# EAGLE design tutorial2 (EAGLE 9.6.2)
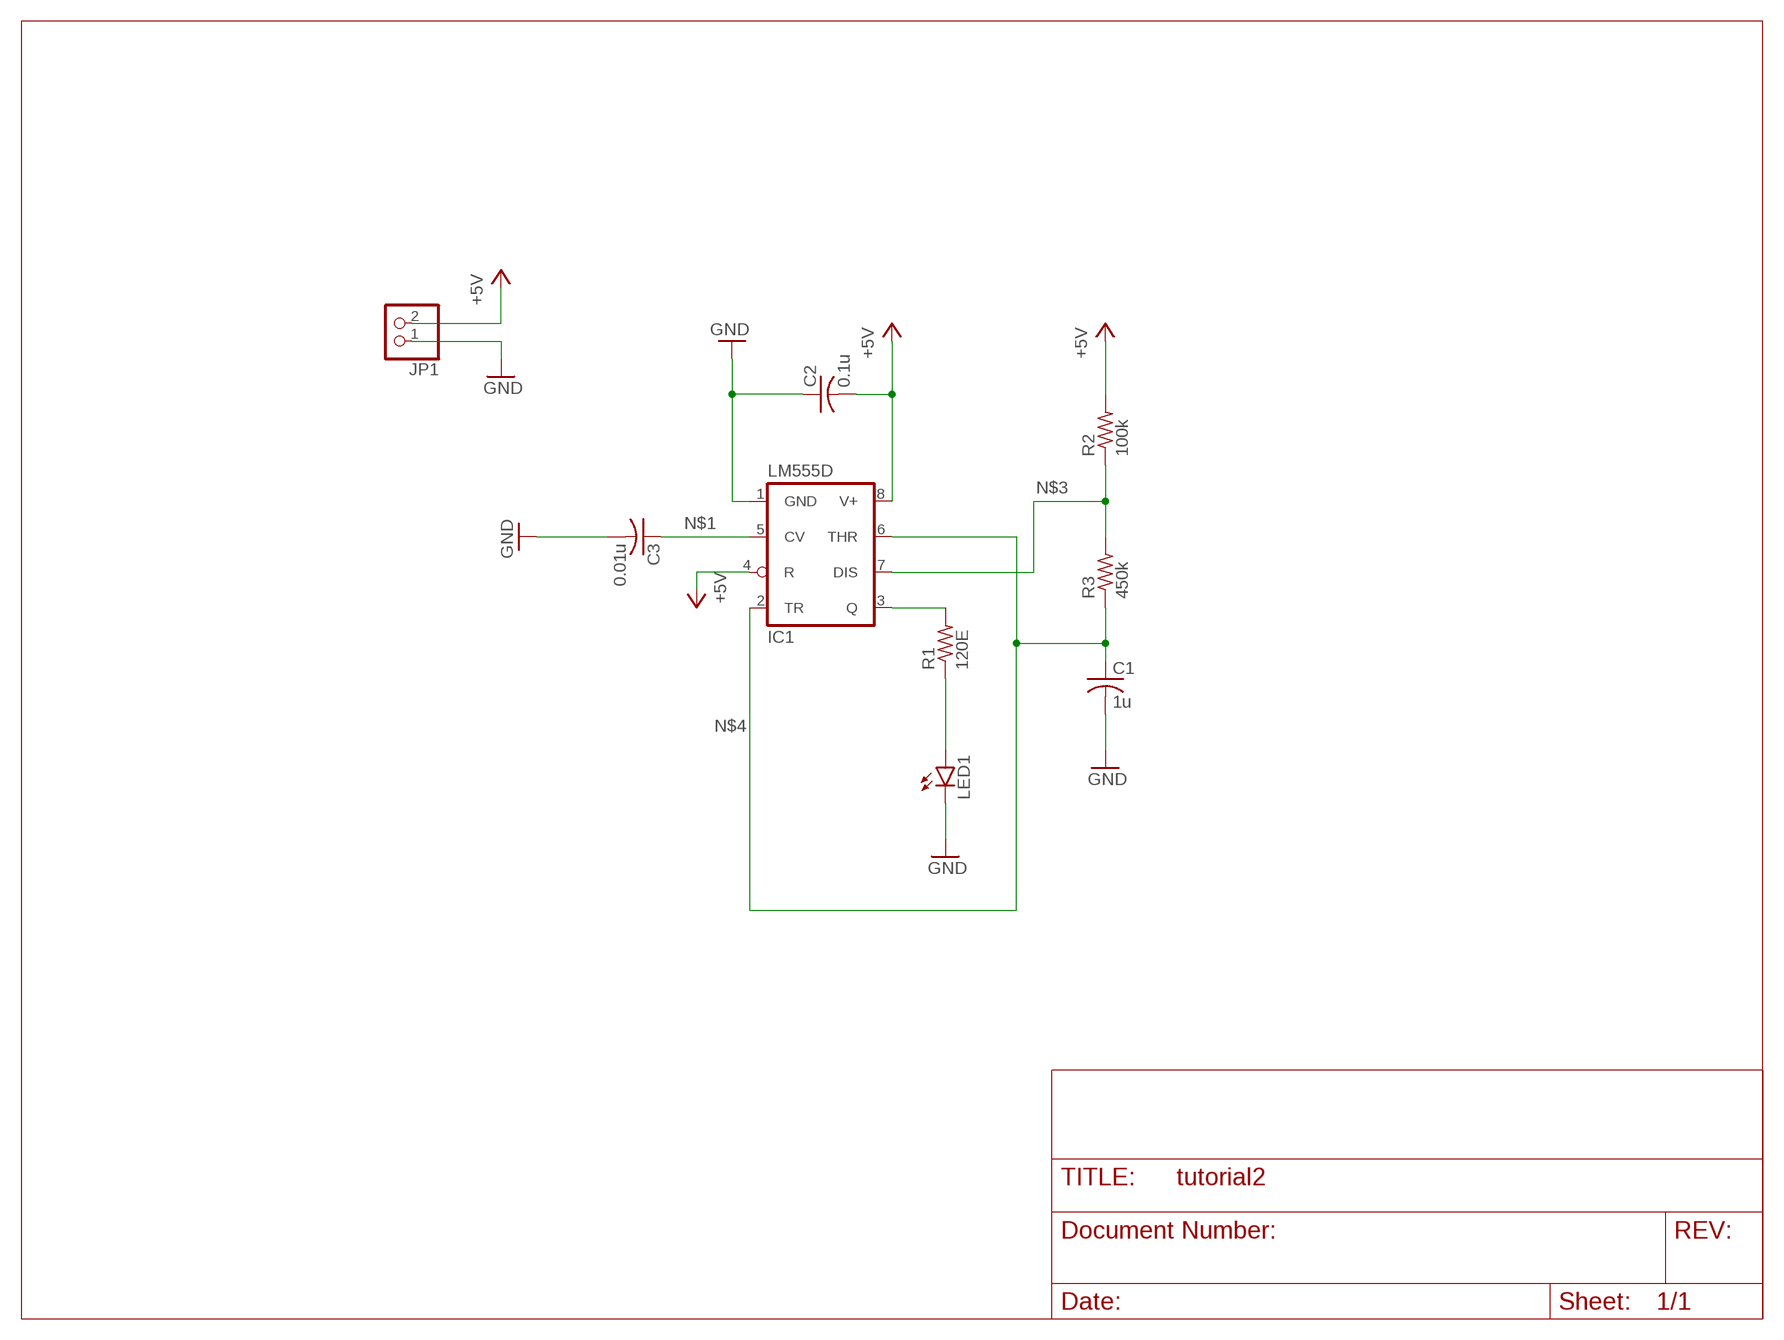
[diagram p0: schematic, sheet 1]

## Parts
C1  1u  C-USC0805  [C0805]
C2  0.1u  C-USC0805  [C0805]
C3  0.01u  C-USC0805  [C0805]
IC1  LM555D  [SO08]
JP1  PINHD-1X2  [1X02]
LED1  LED5MM  [LED5MM]
R1  120E  R-US_R0805  [R0805]
R2  100k  R-US_R0805  [R0805]
R3  450k  R-US_R0805  [R0805]

## Nets
+5V: C2.2 IC1.4(R) IC1.8(V+) JP1.2 R2.2
GND: C1.2 C2.1 C3.2 IC1.1(GND) JP1.1 LED1.K(C)
N$1: C3.1 IC1.5(CV)
N$2: IC1.3(Q) R1.2
N$3: IC1.7(DIS) R2.1 R3.2
N$4: C1.1 IC1.2(TR) IC1.6(THR) R3.1
N$5: LED1.A R1.1

## Library data of the parts
C1-C3 = rcl:C-US: CAPACITOR, American symbol; SPICEPREFIX: C
IC1 = linear:*555: TIMER
JP1 = pinhead:PINHD-1X2: PIN HEADER
LED1 = led:LED: LED OSRAM: - CHIPLED LG R971, LG N971, LY N971, LG Q971, LY Q971, LO R971, LY R971 LH N974, LH R974 LS Q976, LO Q976, LY Q976 LO Q996 - Hyper CHIPLED LW Q18S LB Q993, LB Q99A, LB R99A - SideLED LS A670, LO A670, LY A670, LG A670, LP A670 LB A673, LV A673, LT A673, LW A673 LH A674 LY A675 LS A676, LA A676, LO A676, LY A676, LW A676 LS A679, LY A679, LG A679 - Hyper Micro SIDELED® LS Y876, LA Y876, LO Y876, LY Y876 LT Y87S - SmartLED LW L88C, LW L88S LB L89C, LB L89S, LG L890 LS L89K, LO L89K, LY L89K LS L896, LA L896, LO L896, LY L896 - TOPLED LS T670, LO T670, LY T670, LG T670, LP T670 LSG T670, LSP T670, LSY T670, LOP T670, LYG T670 LG T671, LOG T671, LSG T671 LB T673, LV T673, LT T673, LW T673 LH T674 LS T676, LA T676, LO T676, LY T676, LB T676, LH T676, LSB T676, LW T676 LB T67C, LV T67C, LT T67C, LS T67K, LO T67K, LY T67K, LW E67C LS E67B, LA E67B, LO E67B, LY E67B, LB E67C, LV E67C, LT E67C LW T67C LS T679, LY T679, LG T679 LS T770, LO T770, LY T770, LG T770, LP T770 LB T773, LV T773, LT T773, LW T773 LH T774 LS E675, LA E675, LY E675, LS T675 LS T776, LA T776, LO T776, LY T776, LB T776 LHGB T686 LT T68C, LB T68C - Hyper Mini TOPLED® LB M676 - Mini TOPLED Santana® LG M470 LS M47K, LO M47K, LY M47K Source: http://www.osram.convergy.de LUXEON: - LUMILED® LXK2-PW12-R00, LXK2-PW12-S00, LXK2-PW14-U00, LXK2-PW14-V00 LXK2-PM12-R00, LXK2-PM12-S00, LXK2-PM14-U00 LXK2-PE12-Q00, LXK2-PE12-R00, LXK2-PE12-S00, LXK2-PE14-T00, LXK2-PE14-U00 LXK2-PB12-K00, LXK2-PB12-L00, LXK2-PB12-M00, LXK2-PB14-N00, LXK2-PB14-P00, LXK2-PB14-Q00 LXK2-PR12-L00, LXK2-PR12-M00, LXK2-PR14-Q00, LXK2-PR14-R00 LXK2-PD12-Q00, LXK2-PD12-R00, LXK2-PD12-S00 LXK2-PH12-R00, LXK2-PH12-S00 LXK2-PL12-P00, LXK2-PL12-Q00, LXK2-PL12-R00 Source: www.luxeon.com KINGBRIGHT: KA-3528ASYC Source: www.kingbright.com
R1-R3 = rcl:R-US_: RESISTOR, American symbol; SPICEPREFIX: R

## Board
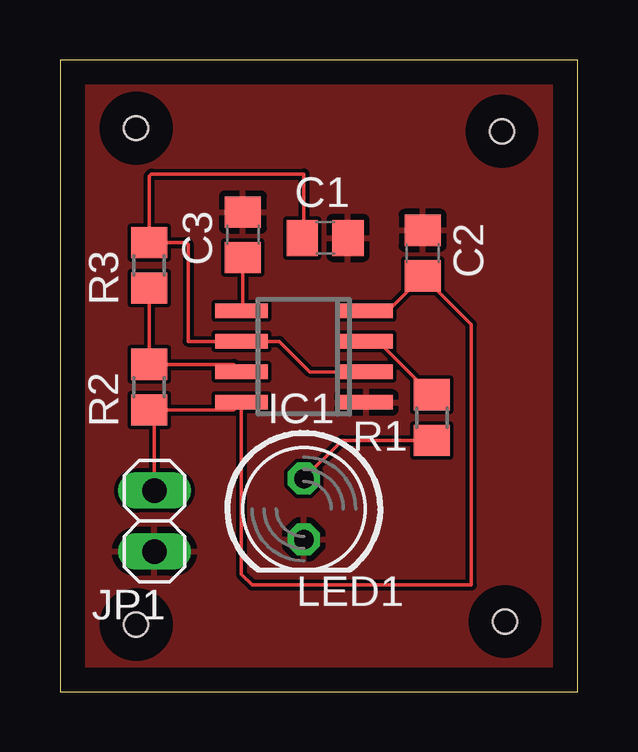
[diagram p1: board, top side]

Size 21.57 x 26.34 mm. Coordinates in mm from the lower left corner, seen from the top.
Outline: 0,0 21.57,0 21.57,26.34 0,26.34 0,0
Copper layers (1*16): Top 0.035mm / dielectric 1.5mm / Bottom 0.035mm
Design rules "default": minimum track width 6mil, minimum drill 0.35mm, track to track 6mil, track to pad 6mil, pad to pad 6mil, via to via 6mil, smd to smd 6mil, copper to edge 40mil, drill to drill 6mil, minimum pad ring 10mil, minimum via ring 8mil, stop-mask expansion 4mil, vias tented up to drill 0mil, thermal gap 10mil
Holes 1 mm at 3.17,23.5 18.41,23.37 18.54,2.92 3.17,2.79

### Footprints (pad centres in the part's own frame; a part is rotated, then mirrored left to right if it is on the bottom)
C0805 = smd 1.3 x 1.5: 1 -0.95,0; 2 0.95,0
SO08 = smd 0.6 x 2.2: 1 -1.905,-2.6; 2 -0.635,-2.6; 3 0.635,-2.6; 4 1.905,-2.6; 5 1.905,2.6; 6 0.635,2.6; 7 -0.635,2.6; 8 -1.905,2.6
1X02 = drill 1.016 long: 1 -1.27,0; 2 1.27,0
LED5MM = drill 0.813 octagon: A -1.27,0; K 1.27,0
R0805 = smd 1.3 x 1.5: 1 -0.95,0; 2 0.95,0

### Placement (x,y rotation side)
C1  11.05,18.92 0 top
C2  15.11,18.29 270 top
C3  7.62,19.05 90 top
IC1  10.16,13.97 90 top
JP1  3.94,7.11 90 top
LED1  10.16,7.62 270 top
R1  15.49,11.43 90 top
R2  3.71,12.7 270 top
R3  3.71,17.78 270 top

### Tracks (layer width: path | path; a pad name or v marks a point on that pad's centre or on a via)
+5V
  Top 0.152: IC1.4 13.65,15.88 C2.2 17.14,15.31 17.14,4.45 8,4.45 7.56,4.89 IC1.8 7.25,11.75 R2.2 3.94,11.52 JP1.2
GND
  pour Top: 0,26.29 0,0 21.59,0 21.59,26.29
N$1
  Top 0.152: C3.1 7.62,15.94 IC1.5
N$2
  Top 0.152: IC1.3 13.27,14.61 R1.2
N$3
  Top 0.152: R3.2 R2.1 7.25,13.65 IC1.7
N$4
  Top 0.152: R3.1 5.27,18.73 5.33,18.67 5.33,14.61 IC1.6 9.14,14.61 10.41,13.34 IC1.2 | R3.1 3.81,18.83 | R3.1 3.71,21.49 3.81,21.59 10.16,21.59 10.16,18.98 C1.1
N$5
  Top 0.152: LED1.A 11.75,10.48 R1.1